# EAGLE design smallversion (EAGLE 7.0.0)
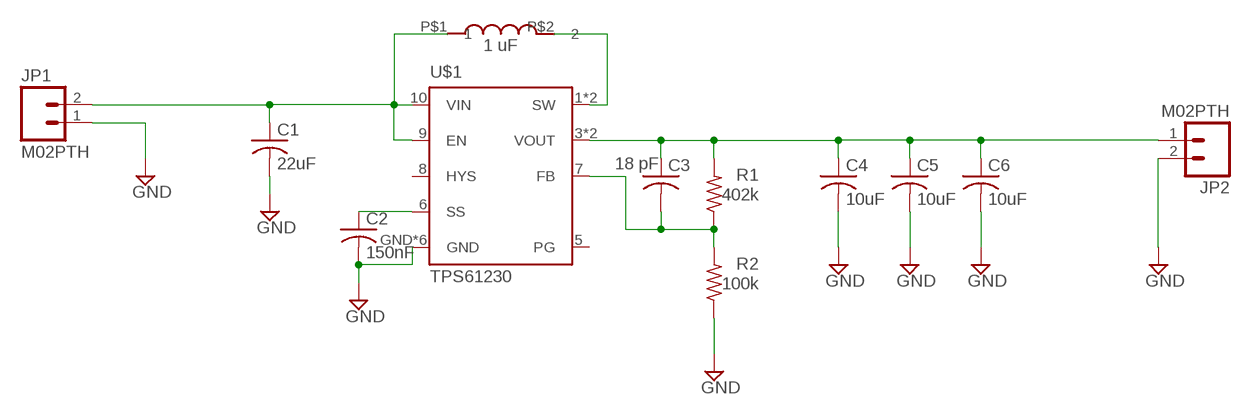
[diagram p0: schematic, sheet 1]

## Parts
C1  22uF  C-USC1206  [C1206]
C2  150nF  C-USC0603K  [C0603K]
C3  18 pF  C-USC0603K  [C0603K]
C4  10uF  C-USC0805K  [C0805K]
C5  10uF  C-USC0805K  [C0805K]
C6  10uF  C-USC0805K  [C0805K]
JP1  M02PTH  [1X02]
JP2  M02PTH  [1X02]
R1  402k  R-US_R0603  [R0603]
R2  100k  R-US_R0603  [R0603]
U$1  TPS61230  [DRC-S-PVSON-N11]
U$3  SRU1028  [SRU1028]

## Nets
GND: C1.2 C2.2 C4.2 C5.2 C6.2 JP1.1 JP2.2 R2.1 U$1.GND U$1.GND@1(GND) U$1.GND@2(GND) U$1.GND@3(GND) U$1.GND@4(GND) U$1.GND@5(GND)
IND: U$1.1(SW) U$1.2(SW) U$3.P$2
N$3: C2.1 U$1.6(SS)
N$6: C3.2 R1.1 R2.2 U$1.7(FB)
VIN: C1.1 JP1.2 U$1.9(EN) U$1.10(VIN) U$3.P$1
VOUT: C3.1 C4.1 C5.1 C6.1 JP2.1 R1.2 U$1.3(VOUT) U$1.4(VOUT)
Unconnected: U$1.8(HYS)

## Notes on the sheet
- 1 uF

## Power pins joined to a net without a drawn wire
PG: U$1.5(PG)

## Library data of the parts
C1 C3-C6 = resistor:C-US: CAPACITOR, American symbol
C2 = adafruit:C-US: CAPACITOR, American symbol
JP1 JP2 = SparkFun-Connectors:M02: Standard 2-pin 0.1" header. Use with - straight break away headers ( PRT-00116) - right angle break away headers (PRT-00553) - swiss pins (PRT-00743) - machine pins (PRT-00117) - female headers (PRT-00115) Molex polarized connector foot print use with: PRT-08233 with associated crimp pins and housings. 2.54_SCREWTERM for use with PRT-10571. 3.5mm Screw Terminal footprints for PRT-08084 5mm Screw Terminal footprints for use with PRT-08433
R1 R2 = adafruit:R-US_: RESISTOR, American symbol
U$1 = texas:TPS61230
U$3 = ti:SRU1028

## Board
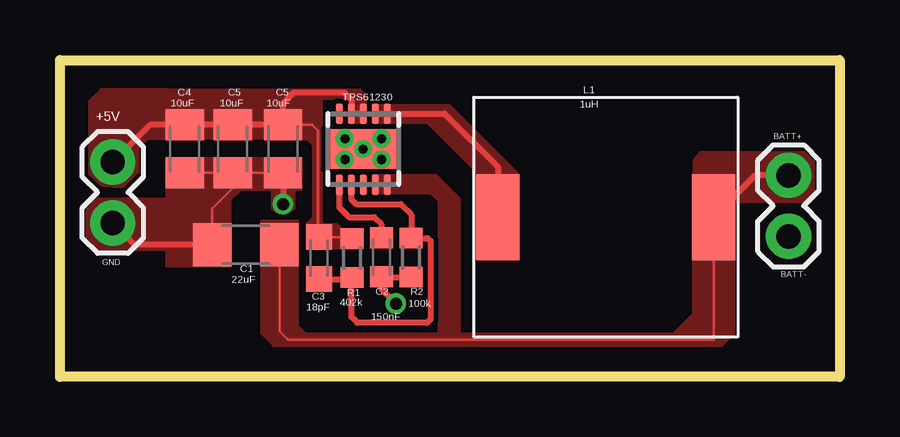
[diagram p1: board, top side]
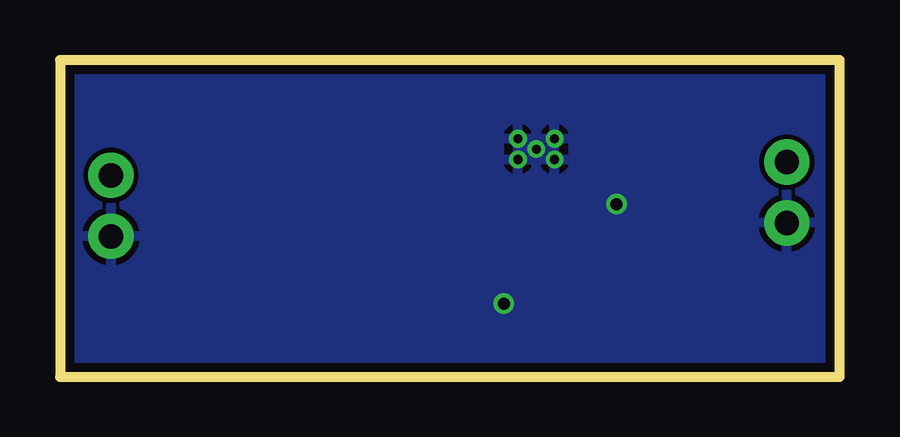
[diagram p2: board, bottom side, seen from below]

Size 32.5 x 13.2 mm. Coordinates in mm from the lower left corner, seen from the top.
Outline: 0,0 0,13.2 32.5,13.2 32.5,0 0,0
Copper layers (1*16): Top 0.0356mm / dielectric 1.5011mm / Bottom 0.0356mm
Design rules "LaenPCBOrder *": minimum track width 6mil, minimum drill 13mil, track to track 8mil, track to pad 8mil, pad to pad 8mil, via to via 8mil, smd to smd 8mil, copper to edge 15mil, drill to drill 6mil, minimum pad ring 7mil, minimum via ring 7mil, stop-mask expansion 0mil, vias tented up to drill 30mil, thermal gap 10mil

### Footprints (pad centres in the part's own frame; a part is rotated, then mirrored left to right if it is on the bottom)
C1206 = smd 1.6 x 1.8: 1 -1.4,0; 2 1.4,0
C0603K = smd 0.864 x 0.965: 1 -0.813,0; 2 0.813,0
C0603K' = smd 1.05 x 1.08: 1 -0.875,0; 2 0.875,0
C0805K = smd 1.3 x 1.6: 1 -1,0; 2 1,0
1X02 = drill 1.016 pad 1.88: 1 0,0; 2 2.54,0
R0603 = smd 0.864 x 0.965: 1 -0.813,0; 2 0.813,0
DRC-S-PVSON-N11 = smd 0.28 x 0.85: 1 -1,-1.475; 2 -0.5,-1.475; 3 0,-1.475; 4 0.5,-1.475; 5 1,-1.475; 6 1,1.475; 7 0.5,1.475; 8 0,1.475; 9 -0.5,1.475; 10 -1,1.475 | smd 3.099 x 1.65: GND 0,0 | drill 0.381 pad 0.559: GND@1 0,0; GND@2 -0.762,0.432; GND@3 -0.762,-0.432; GND@4 0.762,0.432; GND@5 0.762,-0.432
SRU1028 = smd 1.8 x 3.6: P$1 0.9,1.8; P$2 9.9,1.8

### Placement (x,y rotation side)
C1  7.75,5.5 180 top
C2  13.41,4.98 270 top
C3  18 pF  [C0603K']  10.8,4.95 270 top
C4  5.2,9.5 270 top
C5  7.2,9.5 270 top
C6  9.3,9.5 270 top
JP1  30.37,5.85 90 top
JP2  2.2,8.95 270 top
R1  12.17,4.95 90 top
R2  14.64,4.97 90 top
U$1  12.64,9.49 180 top
U$3  28.15,8.45 180 top

### Tracks (layer width: path | path; a pad name or v marks a point on that pad's centre or on a via)
GND  (via drill 0.5)
  Top 0.1: C4.2 C5.2 | C5.2 C6.2 | C5.2 7.2,7.85 6.35,7 C1.2 | 13.42,4.15 C2.2
  Top 0.254: U$1.GND@5 12.21,9.92 U$1.GND@1 | U$1.GND@2 12.65,9.05 11.8,9.9 | 13.42,4.15 R2.1 | C2.2 13.41,3.64 v14,3.05 | C6.2 v9.3,7.2 | C1.2 3.11,5.5 JP2.2
  pour Bottom: 0,13.25 32.45,13.1 32.45,-0.1 0,0.05
  pour Top (no thermals): 4.45,9.1 4.45,4.6 7.1,4.6 7.1,7.35 7.55,7.8 10.05,7.8 10.05,9.1
  pour Top (no thermals): 8.85,7.8 8.85,7 9.1,6.85 9.5,6.85 9.75,7 9.75,7.8
  pour Top (no thermals): 1.2,6.45 1.2,6.95 1.6,7.35 4.6,7.35 4.6,5.35 1.7,5.35 1.2,5.85
IND
  Top 0.254: U$1.2 U$1.1 16.04,10.96 18.25,8.75 U$3.P$2
  pour Top (no thermals): 13.15,11.25 16.2,11.25 19,8.45 19,8.2 17.5,8.2 17.5,8.5 17.4,8.6 15.4,10.6 15.35,10.65 13.15,10.65
N$3
  Top 0.254: U$1.6 11.64,7.06 12.05,6.65 13.1,6.65 13.4,6.35 C2.1
N$6
  Top 0.1: 14.6,5.82 R2.2
  Top 0.254: U$1.7 12.14,7.41 12.35,7.2 14.2,7.2 14.65,6.75 14.65,5.79 R2.2 15.32,5.78 15.45,5.65 15.45,2.4 15.3,2.25 12.4,2.25 12.15,2.5 12.15,4.12 R1.1 12.11,4.08 C3.2
VIN
  Top 0.1: U$1.10 U$1.9 | C1.1 9.15,1.9 9.5,1.55 27.25,1.55 U$3.P$1
  Top 0.254: JP1.2 28.99,8.39 U$3.P$1
  pour Top (no thermals): 31.1,7.35 26.95,7.35 26.5,7.85 26.5,9 26.75,9.3 31,9.3 31.35,8.95 31.35,7.6
  pour Top (no thermals): 28.1,4.9 28.1,1.8 27.6,1.3 8.9,1.3 8.4,1.8 8.4,6.5 9.9,6.5 9.9,2.15 10.25,1.8 25.55,1.8 26.4,2.65 26.4,4.9
  pour Top (no thermals): 13.05,8.4 13.05,7.65 13.7,7.65 15.45,7.65 15.8,7.3 15.8,1.75 16.65,1.75 16.65,7.45 15.7,8.4
VOUT
  Top 0.1: C6.1 10.5,10.5 10.75,10.25 10.75,5.88 C3.1 12.11,5.83 R1.2
  Top 0.254: U$1.3 U$1.4 12.15,11.55 11.85,11.85 9.75,11.85 9.3,11.4 C6.1 C5.1 C4.1 3.75,10.5 JP2.1
  pour Top (no thermals): 12.65,10.65 12.15,10.65 12.15,11.55 12.05,11.65 10.05,11.65 9.95,11.55 9.95,10 4.55,10 4.55,11.9 12.45,11.9 12.65,11.7
  pour Top (no thermals): 10.05,9.9 10.3,9.9 10.55,9.65 10.55,6.65 10.3,6.4 10.3,5.35 12.6,5.35 12.6,6.15 11.75,6.15 11.55,6.35 10.9,6.35 10.9,11.6 10,11.6 10,9.95
  pour Top (no thermals): 2.25,8 2.6,8 3.2,8.6 3.2,9.6 3.5,9.9 3.6,10 4.5,10 4.5,11.9 1.75,11.9 1.45,11.6 1.3,11.45 1.3,8.5 1.75,8.05 2.2,8.05

### Text on the board
tNames: C4 | C5 | C5 | TPS61230 | L1 | +5V | 10uF | 10uF | 10uF | 1uH | BATT+ | GND | 22uF | C1 | BATT- | 18pF | C3 | 402k | R1 | C2 | 100k | R2 | 150nF